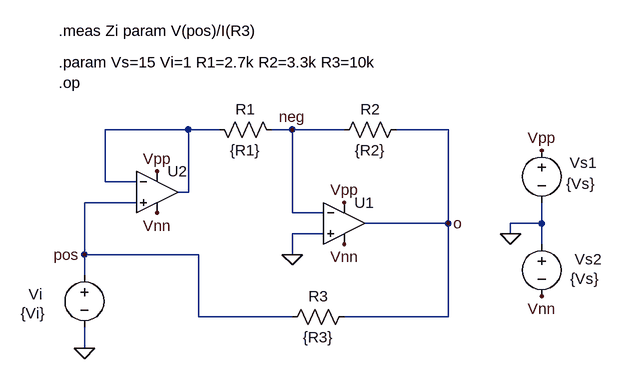
[diagram p0: schematic Amp07op.asc]
Amp07op.asc, the LTspice schematic file:
Version 4
SHEET 1 968 680
WIRE -80 80 -208 80
WIRE -32 80 -80 80
WIRE 80 80 48 80
WIRE 160 80 80 80
WIRE 320 80 240 80
WIRE -208 160 -208 80
WIRE -160 160 -208 160
WIRE -80 176 -80 80
WIRE -80 176 -96 176
WIRE -160 192 -240 192
WIRE 80 208 80 80
WIRE 128 208 80 208
WIRE 320 224 320 80
WIRE 320 224 192 224
WIRE 464 224 464 192
WIRE 464 224 416 224
WIRE 128 240 80 240
WIRE 416 240 416 224
WIRE 464 256 464 224
WIRE -240 272 -240 192
WIRE -64 272 -240 272
WIRE 80 272 80 240
WIRE -240 304 -240 272
WIRE -64 368 -64 272
WIRE 80 368 -64 368
WIRE 320 368 320 224
WIRE 320 368 160 368
WIRE -240 416 -240 384
FLAG 464 112 Vpp
FLAG 416 240 0
FLAG 464 336 Vnn
FLAG 160 192 Vpp
FLAG 160 256 Vnn
FLAG -240 416 0
FLAG 320 224 o
FLAG 80 80 neg
FLAG 80 272 0
FLAG -240 272 pos
FLAG -128 144 Vpp
FLAG -128 208 Vnn
SYMBOL voltage 464 96 R0
WINDOW 123 0 0 Left 0
WINDOW 39 0 0 Left 0
WINDOW 0 43 35 Left 2
WINDOW 3 38 67 Left 2
SYMATTR InstName Vs1
SYMATTR Value {Vs}
SYMBOL voltage 464 240 R0
WINDOW 123 0 0 Left 0
WINDOW 39 0 0 Left 0
WINDOW 0 51 39 Left 2
WINDOW 3 44 69 Left 2
SYMATTR InstName Vs2
SYMATTR Value {Vs}
SYMBOL voltage -240 288 R0
WINDOW 3 -98 74 Left 2
WINDOW 123 0 0 Left 0
WINDOW 39 0 0 Left 0
WINDOW 0 -86 45 Left 2
SYMATTR Value {Vi}
SYMATTR InstName Vi
SYMBOL Opamps\\UniversalOpamp2 160 224 R0
SYMATTR InstName U1
SYMBOL res -48 64 M90
WINDOW 0 0 56 VBottom 2
WINDOW 3 32 56 VTop 2
SYMATTR InstName R1
SYMATTR Value {R1}
SYMBOL res 144 96 R270
WINDOW 0 32 56 VTop 2
WINDOW 3 0 56 VBottom 2
SYMATTR InstName R2
SYMATTR Value {R2}
SYMBOL res 64 384 R270
WINDOW 0 32 56 VTop 2
WINDOW 3 0 56 VBottom 2
SYMATTR InstName R3
SYMATTR Value {R3}
SYMBOL Opamps\\UniversalOpamp2 -128 176 R0
SYMATTR InstName U2
TEXT -280 -24 Left 2 !.param Vs=15 Vi=1 R1=2.7k R2=3.3k R3=10k
TEXT -280 8 Left 2 !.op
TEXT -280 -72 Left 2 !.meas Zi param V(pos)/I(R3)

The netlist it stands for:
* Amp07op.asc
Vs1 Vpp 0 {Vs}
Vs2 0 Vnn {Vs}
Vi pos 0 {Vi}
XU1 0 neg Vpp Vnn o level.2 Avol=1Meg GBW=10Meg Slew=10Meg ilimit=25m rail=0 Vos=0 phimargin=45 en=0 enk=0 in=0 ink=0 Rin=500Meg  ; pins IN+ IN- V+ V- OUT
R1 N001 neg {R1}
R2 neg o {R2}
R3 pos o {R3}
XU2 pos N001 Vpp Vnn N001 level.2 Avol=1Meg GBW=10Meg Slew=10Meg ilimit=25m rail=0 Vos=0 phimargin=45 en=0 enk=0 in=0 ink=0 Rin=500Meg  ; pins IN+ IN- V+ V- OUT
.param Vs=15 Vi=1 R1=2.7k R2=3.3k R3=10k
.op
.meas Zi param V(pos)/I(R3)
.lib UniversalOpamps2.sub
.backanno
.end